# EAGLE schematic VisSleepSchema (EAGLE 9.6.2)
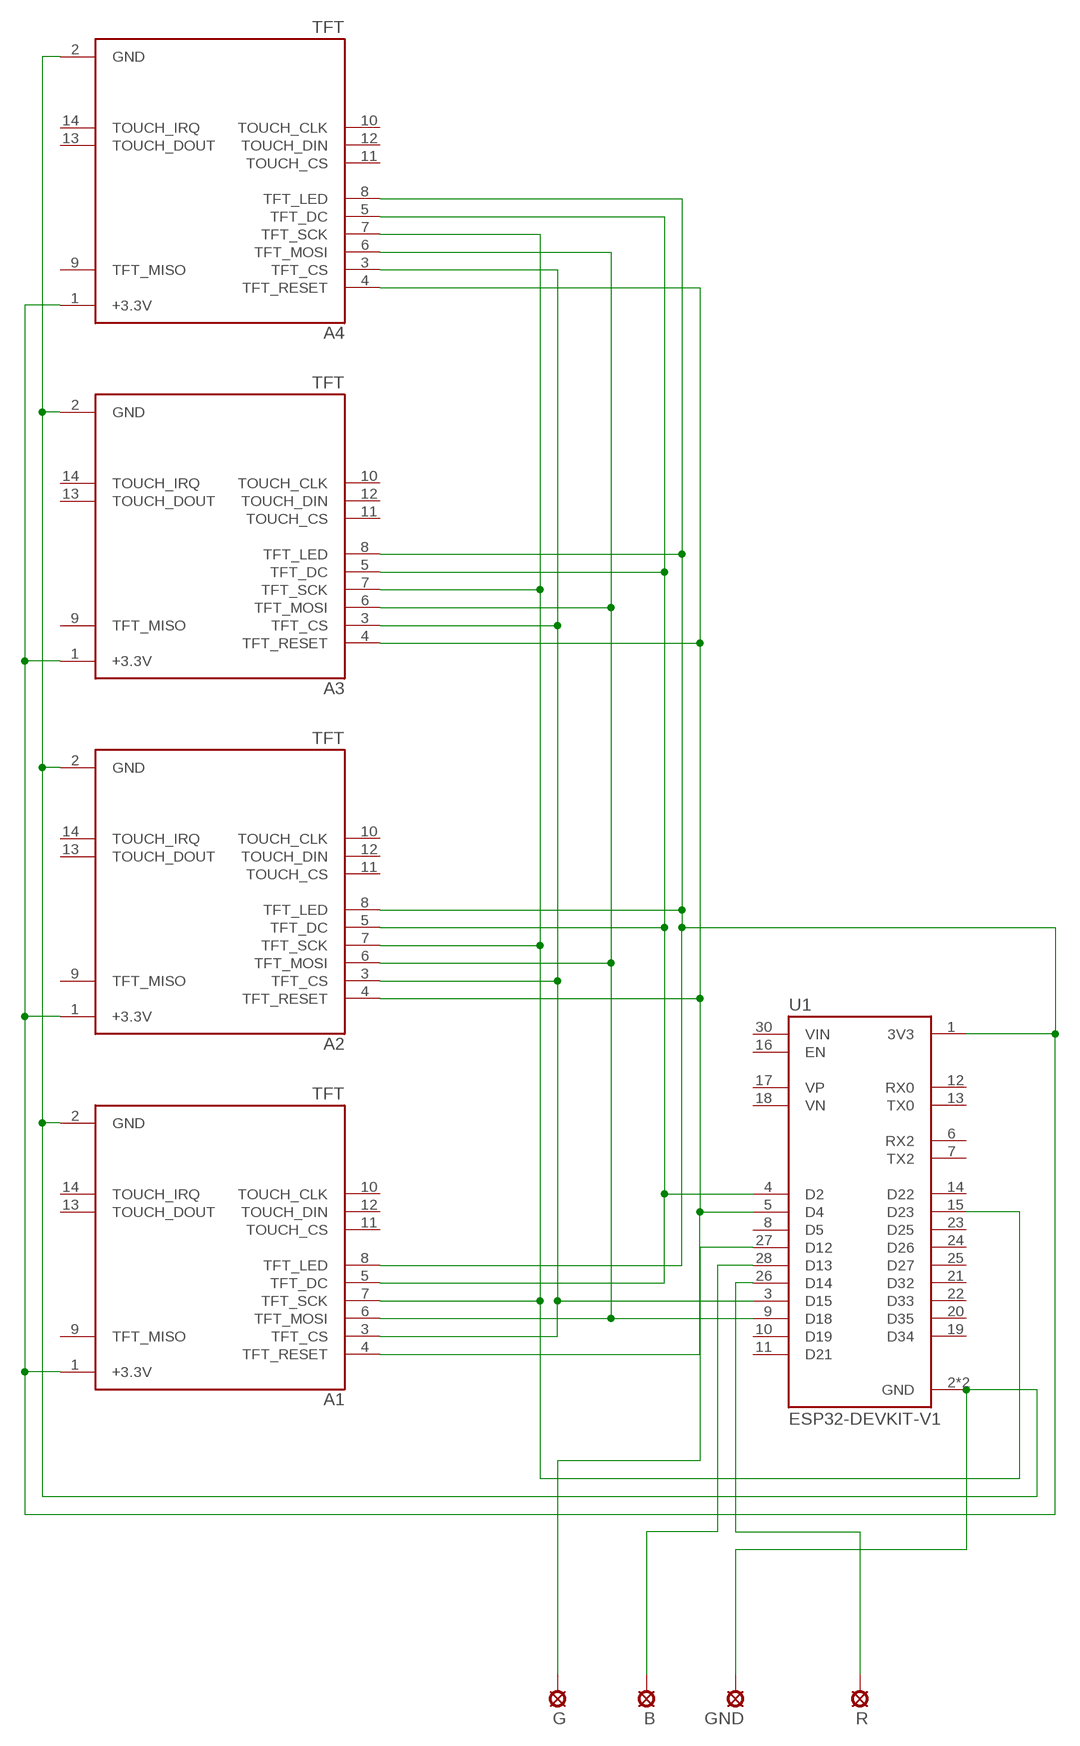
[diagram p0: schematic, sheet 1]

## Parts
A1  TFT  [2.8_LCD]
A2  TFT  [2.8_LCD]
A3  TFT  [2.8_LCD]
A4  TFT  [2.8_LCD]
B  LSP10  [LSP10]
G  LSP10  [LSP10]
GND  LSP10  [LSP10]
R  LSP10  [LSP10]
U1  ESP32-DEVKIT-V1  [MODULE_ESP32_DEVKIT_V1]

## Nets
N$1: A1.1(+3.3V) A1.8(TFT_LED) A2.1(+3.3V) A2.8(TFT_LED) A3.1(+3.3V) A3.8(TFT_LED) A4.1(+3.3V) A4.8(TFT_LED) U1.1(3V3)
N$2: A1.2(GND) A2.2(GND) A3.2(GND) A4.2(GND) GND.MP U1.2(GND) U1.29(GND)
N$3: A1.3(TFT_CS) A2.3(TFT_CS) A3.3(TFT_CS) A4.3(TFT_CS) U1.3(D15)
N$4: B.MP U1.28(D13)
N$5: G.MP U1.27(D12)
N$6: A1.4(TFT_RESET) A2.4(TFT_RESET) A3.4(TFT_RESET) A4.4(TFT_RESET) U1.5(D4)
N$7: A1.5(TFT_DC) A2.5(TFT_DC) A3.5(TFT_DC) A4.5(TFT_DC) U1.4(D2)
N$8: A1.6(TFT_MOSI) A2.6(TFT_MOSI) A3.6(TFT_MOSI) A4.6(TFT_MOSI) U1.9(D18)
N$9: A1.7(TFT_SCK) A2.7(TFT_SCK) A3.7(TFT_SCK) A4.7(TFT_SCK) U1.15(D23)
N$10: R.MP U1.26(D14)
Unconnected: A1.9(TFT_MISO) A1.10(TOUCH_CLK) A1.11(TOUCH_CS) A1.12(TOUCH_DIN) A1.13(TOUCH_DOUT) A1.14(TOUCH_IRQ) A2.9(TFT_MISO) A2.10(TOUCH_CLK) A2.11(TOUCH_CS) A2.12(TOUCH_DIN) A2.13(TOUCH_DOUT) A2.14(TOUCH_IRQ) A3.9(TFT_MISO) A3.10(TOUCH_CLK) A3.11(TOUCH_CS) A3.12(TOUCH_DIN) A3.13(TOUCH_DOUT) A3.14(TOUCH_IRQ) A4.9(TFT_MISO) A4.10(TOUCH_CLK) A4.11(TOUCH_CS) A4.12(TOUCH_DIN) A4.13(TOUCH_DOUT) A4.14(TOUCH_IRQ) U1.6(RX2) U1.7(TX2) U1.8(D5) U1.10(D19) U1.11(D21) U1.12(RX0) U1.13(TX0) U1.14(D22) U1.16(EN) U1.17(VP) U1.18(VN) U1.19(D34) U1.20(D35) U1.21(D32) U1.22(D33) U1.23(D25) U1.24(D26) U1.25(D27) U1.30(VIN)

## Library data of the parts
A1-A4 = tft:TFT
B G GND R = solpad:LSP10: SOLDER PAD drill 1.0 mm, distributor Buerklin, 12H555
U1 = ESP32-DEVKIT-V1:ESP32-DEVKIT-V1: Dual core, Wi-Fi: 2.4 GHz up to 150 Mbits/s,BLE (Bluetooth Low Energy) and legacy Bluetooth, 32 bits, Up to 240 MHz Check availability <https://pricing.snapeda.com/parts/ESP32-DEVKIT-V1/Do%20it/view-part?ref=eda>; AVAILABILITY: Not in stock; CHECK_PRICES: https://www.snapeda.com/parts/ESP32-DEVKIT-V1/Do+it/view-part/?ref=eda; DESCRIPTION: Dual core, Wi-Fi: 2.4 GHz up to 150 Mbits/s,BLE (Bluetooth Low Energy) and legacy Bluetooth, 32 bits, Up to 240 MHz; MF: Do it; MP: ESP32-DEVKIT-V1; PACKAGE: None; PRICE: None; SNAPEDA_LINK: https://www.snapeda.com/parts/ESP32-DEVKIT-V1/Do+it/view-part/?ref=snap